# Altium schematic sheet EPM1270.SchDoc
size A4; Organization: Altium Limited; Address1: L3, 12a Rodborough Rd; Address2: Frenchs Forest; Address3: NSW; Address4: Australia 2086; SheetNumber: 4; SheetTotal: 8
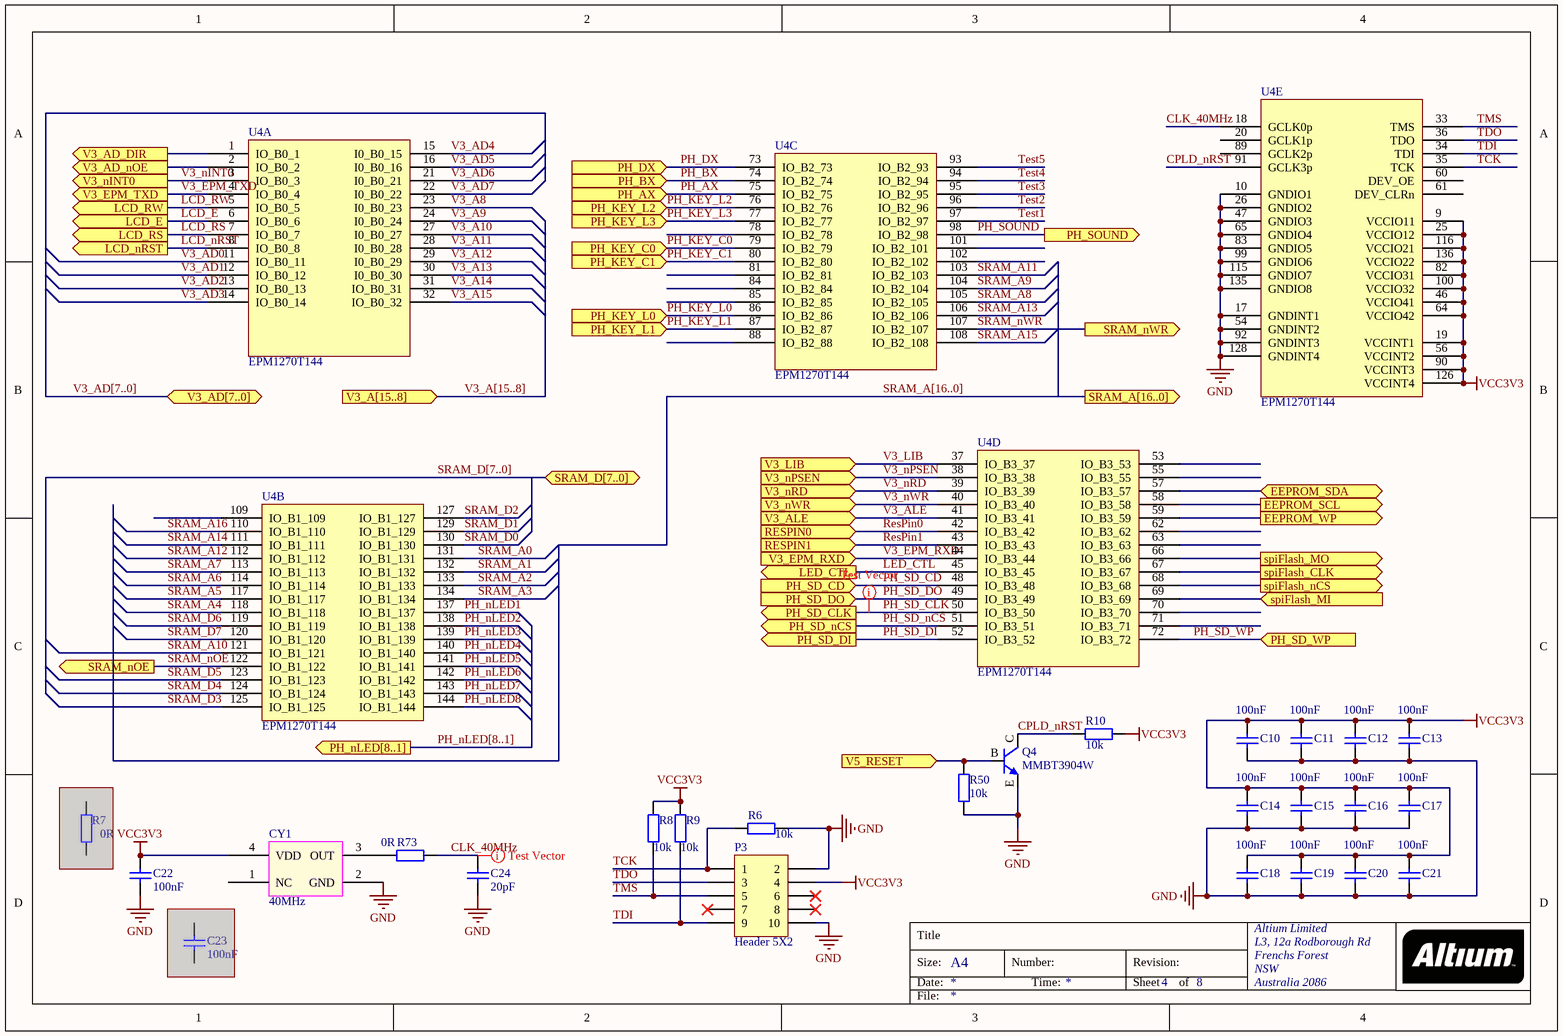
[diagram p0: EPM1270.SchDoc]

## Parts
C10  100nF  [R0603]
C11  100nF  [R0603]
C12  100nF  [R0603]
C13  100nF  [R0603]
C14  100nF  [R0603]
C15  100nF  [R0603]
C16  100nF  [R0603]
C17  100nF  [R0603]
C18  100nF  [R0603]
C19  100nF  [R0603]
C20  100nF  [R0603]
C21  100nF  [R0603]
C22  100nF  [R0603]
C23  100nF  [R0603]  (masked out: inside a compile mask, not in the netlist)
C24  value 20pF  [R0603]  (hidden comment: 100nF)
CY1  40MHz  [XCY4_5032]
P3  Header 5X2  [HDR2X5]
Q4  MMBT3904W  [SOT_23]
R6  10k  [R0603]
R7  0R  [R0603]  (masked out: inside a compile mask, not in the netlist)
R8  10k  [R0603]
R9  10k  [R0603]
R10  10k  [R0603]
R50  10k  [R0603]
R73  0R  [R0603]
U4  EPM1270T144  [EPM1270T144-TQFP]  (parts A,B,C,D,E of 5)

## Ports
EEPROM_SCL (out), EEPROM_SDA (bidir), EEPROM_WP (out), LCD_E (out), LCD_nRST (out), LCD_RS (out), LCD_RW (out), LED_CTL (out), PH_AX (in), PH_BX (in), PH_DX (in), PH_KEY_C0 (in), PH_KEY_C1 (in), PH_KEY_L0 (in), PH_KEY_L1 (in), PH_KEY_L2 (in), PH_KEY_L3 (in), PH_nLED[8..1] (out), PH_SD_CD (in), PH_SD_CLK (out), PH_SD_DI (out), PH_SD_DO (in), PH_SD_nCS (out), PH_SD_WP (in), PH_SOUND (out), RESPIN0 (in), RESPIN1 (in), spiFlash_CLK (out), spiFlash_MI (in), spiFlash_MO (out), spiFlash_nCS (out), SRAM_A[16..0] (out), SRAM_D[7..0] (bidir), SRAM_nOE (out), SRAM_nWR (out), V3_A[15..8] (in), V3_AD[7..0] (bidir), V3_AD_DIR (out), V3_AD_nOE (out), V3_ALE (in), V3_EPM_RXD (in), V3_EPM_TXD (out), V3_LIB (in), V3_nINT0 (out), V3_nPSEN (in), V3_nRD (in), V3_nWR (in), V5_RESET (in)

## Nets
GND: C10.2 C11.2 C12.2 C13.2 C14.2 C15.2 C16.2 C17.2 C18.2 C19.2 C20.2 C21.2 C22.2 C24.2 CY1.2(GND) P3.2 P3.10 Q4.E R6.1 R50.2 U4.10(GNDIO1) U4.17(GNDINT1) U4.26(GNDIO2) U4.47(GNDIO3) U4.54(GNDINT2) U4.65(GNDIO4) U4.83(GNDIO5) U4.92(GNDINT3) U4.99(GNDIO6) U4.115(GNDIO7) U4.128(GNDINT4) U4.135(GNDIO8)
VCC3V3: C10.1 C11.1 C12.1 C13.1 C14.1 C15.1 C16.1 C17.1 C18.1 C19.1 C20.1 C21.1 C22.1 CY1.4(VDD) P3.4 R8.2 R9.2 R10.2 U4.9(VCCIO11) U4.19(VCCINT1) U4.25(VCCIO12) U4.46(VCCIO41) U4.56(VCCINT2) U4.64(VCCIO42) U4.82(VCCIO31) U4.90(VCCINT3) U4.100(VCCIO32) U4.116(VCCIO21) U4.126(VCCINT4) U4.136(VCCIO22)
CLK_40MHz: C24.1 R73.2 U4.18(GCLK0p)
CPLD_nRST: Q4.C R10.1 U4.91(GCLK3p)
EEPROM_SCL: U4.58(IO_B3_58) ; port EEPROM_SCL
EEPROM_SDA: U4.57(IO_B3_57) ; port EEPROM_SDA
EEPROM_WP: U4.59(IO_B3_59) ; port EEPROM_WP
LCD_E: U4.6(IO_B0_6) ; port LCD_E
LCD_nRST: U4.8(IO_B0_8) ; port LCD_nRST
LCD_RS: U4.7(IO_B0_7) ; port LCD_RS
LCD_RW: U4.5(IO_B0_5) ; port LCD_RW
LED_CTL: U4.45(IO_B3_45) ; port LED_CTL
PH_AX: U4.75(IO_B2_75) ; port PH_AX
PH_BX: U4.74(IO_B2_74) ; port PH_BX
PH_DX: U4.73(IO_B2_73) ; port PH_DX
PH_KEY_C0: U4.79(IO_B2_79) ; port PH_KEY_C0
PH_KEY_C1: U4.80(IO_B2_80) ; port PH_KEY_C1
PH_KEY_L0: U4.86(IO_B2_86) ; port PH_KEY_L0
PH_KEY_L1: U4.87(IO_B2_87) ; port PH_KEY_L1
PH_KEY_L2: U4.76(IO_B2_76) ; port PH_KEY_L2
PH_KEY_L3: U4.77(IO_B2_77) ; port PH_KEY_L3
PH_nLED1: U4.137(IO_B1_137)
PH_nLED2: U4.138(IO_B1_138)
PH_nLED3: U4.139(IO_B1_139)
PH_nLED4: U4.140(IO_B1_140)
PH_nLED5: U4.141(IO_B1_141)
PH_nLED6: U4.142(IO_B1_142)
PH_nLED7: U4.143(IO_B1_143)
PH_nLED8: U4.144(IO_B1_144)
PH_SD_CD: U4.48(IO_B3_48) ; port PH_SD_CD
PH_SD_CLK: U4.50(IO_B3_50) ; port PH_SD_CLK
PH_SD_DI: U4.52(IO_B3_52) ; port PH_SD_DI
PH_SD_DO: U4.49(IO_B3_49) ; port PH_SD_DO
PH_SD_nCS: U4.51(IO_B3_51) ; port PH_SD_nCS
PH_SD_WP: U4.72(IO_B3_72) ; port PH_SD_WP
PH_SOUND: U4.98(IO_B2_98) ; port PH_SOUND
ResPin0: U4.42(IO_B3_42) ; port RESPIN0
ResPin1: U4.43(IO_B3_43) ; port RESPIN1
spiFlash_CLK: U4.67(IO_B3_67) ; port spiFlash_CLK
spiFlash_MI: U4.69(IO_B3_69) ; port spiFlash_MI
spiFlash_MO: U4.66(IO_B3_66) ; port spiFlash_MO
spiFlash_nCS: U4.68(IO_B3_68) ; port spiFlash_nCS
SRAM_A0: U4.131(IO_B1_131)
SRAM_A1: U4.132(IO_B1_132)
SRAM_A2: U4.133(IO_B1_133)
SRAM_A3: U4.134(IO_B1_134)
SRAM_A4: U4.118(IO_B1_118)
SRAM_A5: U4.117(IO_B1_117)
SRAM_A6: U4.114(IO_B1_114)
SRAM_A7: U4.113(IO_B1_113)
SRAM_A8: U4.105(IO_B2_105)
SRAM_A9: U4.104(IO_B2_104)
SRAM_A10: U4.121(IO_B1_121)
SRAM_A11: U4.103(IO_B2_103)
SRAM_A12: U4.112(IO_B1_112)
SRAM_A13: U4.106(IO_B2_106)
SRAM_A14: U4.111(IO_B1_111)
SRAM_A15: U4.108(IO_B2_108)
SRAM_A16: U4.110(IO_B1_110)
SRAM_D0: U4.130(IO_B1_130)
SRAM_D1: U4.129(IO_B1_129)
SRAM_D2: U4.127(IO_B1_127)
SRAM_D3: U4.125(IO_B1_125)
SRAM_D4: U4.124(IO_B1_124)
SRAM_D5: U4.123(IO_B1_123)
SRAM_D6: U4.119(IO_B1_119)
SRAM_D7: U4.120(IO_B1_120)
SRAM_nOE: U4.122(IO_B1_122) ; port SRAM_nOE
SRAM_nWR: U4.107(IO_B2_107) ; port SRAM_nWR
TCK: P3.1 R6.2 U4.35(TCK)
TDI: P3.9 R9.1 U4.34(TDI)
TDO: P3.3 U4.36(TDO)
Test1: U4.97(IO_B2_97)
Test2: U4.96(IO_B2_96)
Test3: U4.95(IO_B2_95)
Test4: U4.94(IO_B2_94)
Test5: U4.93(IO_B2_93)
TMS: P3.5 R8.1 U4.33(TMS)
V3_A8: U4.23(I0_B0_23)
V3_A9: U4.24(I0_B0_24)
V3_A10: U4.27(I0_B0_27)
V3_A11: U4.28(I0_B0_28)
V3_A12: U4.29(I0_B0_29)
V3_A13: U4.30(I0_B0_30)
V3_A14: U4.31(IO_B0_31)
V3_A15: U4.32(IO_B0_32)
V3_AD0: U4.11(IO_B0_11)
V3_AD1: U4.12(IO_B0_12)
V3_AD2: U4.13(IO_B0_13)
V3_AD3: U4.14(IO_B0_14)
V3_AD4: U4.15(I0_B0_15)
V3_AD5: U4.16(I0_B0_16)
V3_AD6: U4.21(I0_B0_21)
V3_AD7: U4.22(I0_B0_22)
V3_AD_DIR: U4.1(IO_B0_1) ; port V3_AD_DIR
V3_AD_nOE: U4.2(IO_B0_2) ; port V3_AD_nOE
V3_ALE: U4.41(IO_B3_41) ; port V3_ALE
V3_EPM_RXD: U4.44(IO_B3_44) ; port V3_EPM_RXD
V3_EPM_TXD: U4.4(IO_B0_4) ; port V3_EPM_TXD
V3_LIB: U4.37(IO_B3_37) ; port V3_LIB
V3_nINT0: U4.3(IO_B0_3) ; port V3_nINT0
V3_nPSEN: U4.38(IO_B3_38) ; port V3_nPSEN
V3_nRD: U4.39(IO_B3_39) ; port V3_nRD
V3_nWR: U4.40(IO_B3_40) ; port V3_nWR
V5_RESET: Q4.B R50.1 ; port V5_RESET
NetCY1_3: CY1.3(OUT) R73.1

Not connected (* = marked no-connect by the designer): CY1 1(NC); P3 6* 7* 8*; U4 20(GCLK1p) 53(IO_B3_53) 55(IO_B3_55) 60(DEV_OE) 61(DEV_CLRn) 62(IO_B3_62) 63(IO_B3_63) 70(IO_B3_70) 71(IO_B3_71) 78(IO_B2_78) 81(IO_B2_81) 84(IO_B2_84) 85(IO_B2_85) 88(IO_B2_88) 89(GCLK2p) 101(IO_B2_101) 102(IO_B2_102) 109(IO_B1_109)

## Buses and harness runs
bus PH_nLED[8..1] = port PH_nLED[8..1]
bus SRAM_A[16..0] = port SRAM_A[16..0]
bus SRAM_D[7..0] = port SRAM_D[7..0]
bus V3_A[15..8] = port V3_A[15..8]
bus V3_AD[7..0] = port V3_AD[7..0]

## Layout directives
Column: TestVectorIndex: CLK_40MHz, PH_SD_CLK

## Notes on the sheet
- Title
- Size:
- Date:
- A4
- Number:
- Time:
- Revision:
- Sheet
- of
- File:

## Library data of the parts
C10-C24 = CAP_04
  C10-C23: Value: 100nF
CY1 = XTAL_4P: Active crystal
P3 = Header 5X2: Header, 5-Pin, Dual row; LatestRevisionDate: 17-Jul-2002; LatestRevisionNote: Re-released for DXP Platform.; Publisher: Altium Limited
Q4 = MMBT3904TT1G
R6-R10 R50 R73 = RES_04: 0402
  R6 R8-R10 R50: Value: 10K
  R7 R73: Value: 0R